# EAGLE design Amplifier (EAGLE 7.2.0)
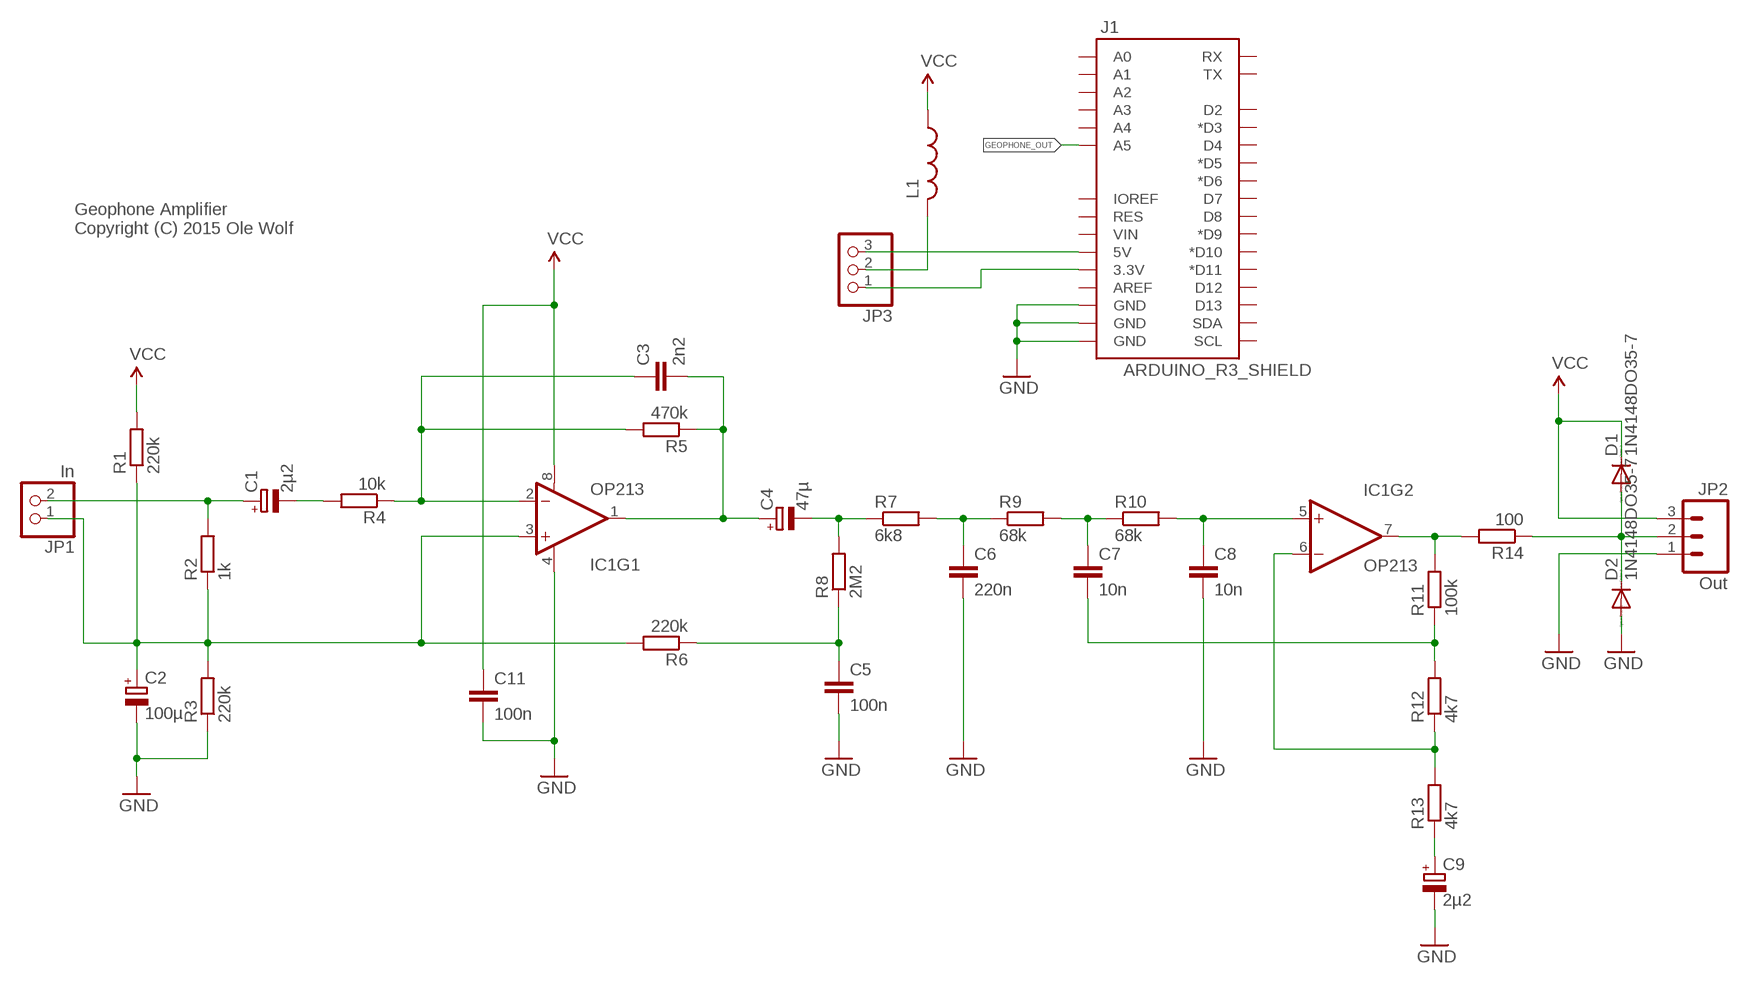
[diagram p0: schematic, sheet 1]

## Parts
C1  2µ2  CPOL-EUE2-5  [E2-5]
C2  100µ  CPOL-EUE2-5  [E2-5]
C3  2n2  C-EU025-025X050  [C025-025X050]
C4  47µ  CPOL-EUE2-5  [E2-5]
C5  100n  C-EU025-025X050  [C025-025X050]
C6  220n  C-EU025-025X050  [C025-025X050]
C7  10n  C-EU025-025X050  [C025-025X050]
C8  10n  C-EU025-025X050  [C025-025X050]
C9  2µ2  CPOL-EUE2-5  [E2-5]
C11  100n  C-EU025-025X050  [C025-025X050]
D1  1N4148DO35-7  [DO35-7]
D2  1N4148DO35-7  [DO35-7]
IC1  OP213  LM358  [DIP08]
J1  ARDUINO_R3_SHIELD  [UNO_R3_SHIELD]
JP1  In  PINHD-1X2  [1X02]
JP2  Out  M03LONGPADS  [1X03_LONGPADS]
JP3  PINHD-1X3  [1X03]
L1  L-US0207/2V  [0207/2V]
R1  220k  R-EU_0207/12  [0207/12]
R2  1k  R-EU_0207/12  [0207/12]
R3  220k  R-EU_0207/12  [0207/12]
R4  10k  R-EU_0207/12  [0207/12]
R5  470k  R-EU_0207/12  [0207/12]
R6  220k  R-EU_0207/12  [0207/12]
R7  6k8  R-EU_0207/12  [0207/12]
R8  2M2  R-EU_0207/12  [0207/12]
R9  68k  R-EU_0207/12  [0207/12]
R10  68k  R-EU_0207/12  [0207/12]
R11  100k  R-EU_0207/12  [0207/12]
R12  4k7  R-EU_0207/12  [0207/12]
R13  4k7  R-EU_0207/12  [0207/12]
R14  100  R-EU_0207/12  [0207/12]

## Nets
GEOPHONE_OUT: D1.A D2.C J1.A5 JP2.2 R14.1
GND: C2.- C5.2 C6.2 C8.2 C9.- C11.2 D2.A IC1.4(V-) J1.GND@0(GND) J1.GND@1(GND) J1.GND@2(GND) JP2.1 R3.1
N$1: C2.+ IC1.3(+IN) JP1.1 R1.1 R2.1 R3.2 R6.2
N$2: C1.- R4.2
N$3: C5.1 R6.1 R8.1
N$4: C3.1 IC1.2(-IN) R4.1 R5.2
N$5: C1.+ JP1.2 R2.2
N$6: C6.1 R7.2 R9.1
N$7: JP3.2 L1.2
N$8: IC1.6(-IN) R12.1 R13.2
N$9: C3.2 C4.+ IC1.1(OUT) R5.1
N$10: C4.- R7.1 R8.2
N$11: C7.1 R9.2 R10.1
N$12: C9.+ R13.1
N$13: C8.1 IC1.5(+IN) R10.2
N$14: J1.3.3V JP3.1
N$15: C7.2 R11.1 R12.2
N$16: IC1.7(OUT) R11.2 R14.2
N$17: J1.5V JP3.3
VCC: C11.1 D1.C IC1.8(V+) JP2.3 L1.1 R1.2
Unconnected: J1.A0 J1.A1 J1.A2 J1.A3 J1.A4 J1.AREF J1.D2 J1.D3(*D3) J1.D4 J1.D5(*D5) J1.D6(*D6) J1.D7 J1.D8 J1.D9(*D9) J1.D10(*D10) J1.D11(*D11) J1.D12 J1.D13 J1.IOREF J1.RES J1.RX J1.SCL J1.SDA J1.TX J1.VIN

## Notes on the sheet
- Geophone Amplifier
  Copyright (C) 2015 Ole Wolf

## Library data of the parts
C1 C2 C4 C9 = rcl:CPOL-EU: POLARIZED CAPACITOR, European symbol
C3 C5-C8 C11 = rcl:C-EU: CAPACITOR, European symbol
D1 D2 = diode:1N4148: DIODE high speed (Philips)
IC1 = SparkFun-AnalogIC:LM358: Jellybean op-amp; PROD_ID: IC-09172
J1 = SparkFun-Boards:ARDUINO_R3_SHIELD: Shield form compatible with the Arduino Uno R3.
JP1 = pinhead:PINHD-1X2: PIN HEADER
JP2 = SparkFun-Connectors:M03: Header 3 Standard 3-pin 0.1" header. Use with straight break away headers (SKU : PRT-00116), right angle break away headers (PRT-00553), swiss pins (PRT-00743), machine pins (PRT-00117), and female headers (PRT-00115). Molex polarized connector foot print use with SKU : PRT-08232 with associated crimp pins and housings.
JP3 = pinhead:PINHD-1X3: PIN HEADER
L1 = rcl:L-US: INDUCTOR, American symbol
R1-R14 = resistor:R-EU_: RESISTOR, European symbol

## Board
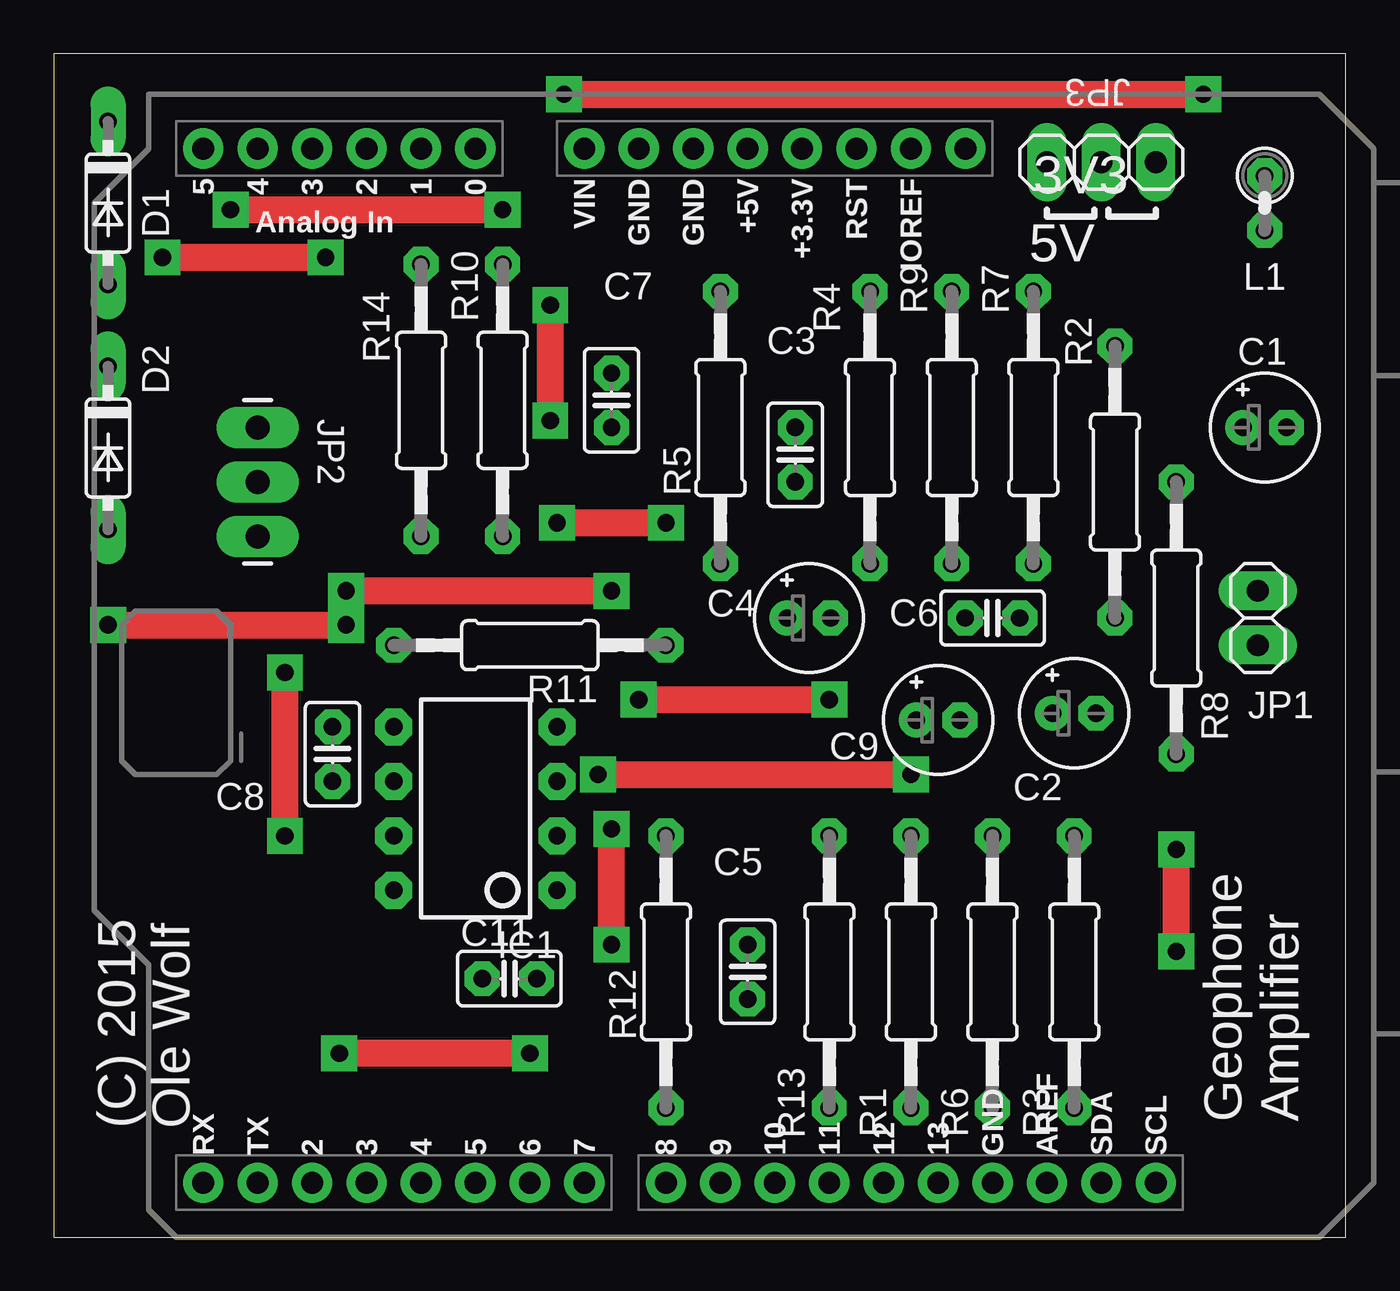
[diagram p1: board, top side]
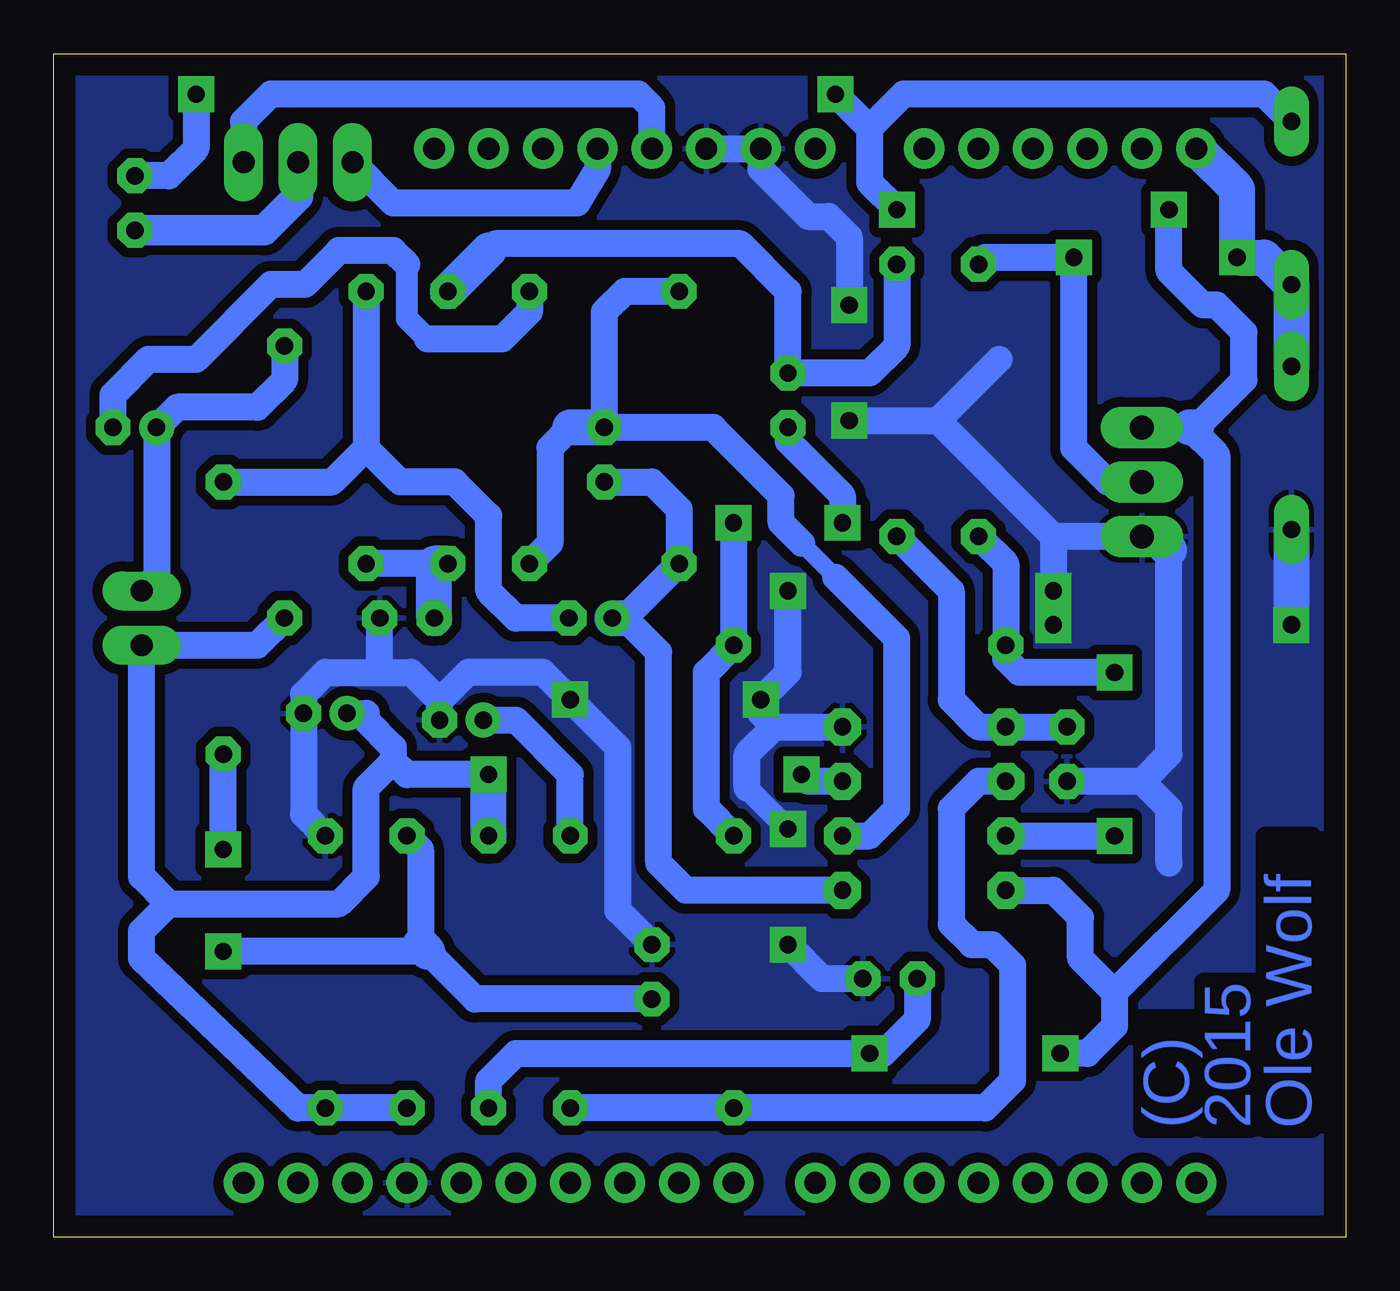
[diagram p2: board, bottom side, seen from below]

Size 60.3 x 55.23 mm. Coordinates in mm from the lower left corner, seen from the top.
Outline: 0,0 60.3,0 60.3,55.23 0,55.23 0,0
Copper layers (1*16): Top 0.035mm / dielectric 1.5mm / Bottom 0.035mm
Design rules "default *": minimum track width 10mil, minimum drill 24mil, track to track 18mil, track to pad 18mil, pad to pad 18mil, via to via 18mil, smd to smd 8mil, copper to edge 40mil, drill to drill 8mil, minimum pad ring 16mil, minimum via ring 12mil, stop-mask expansion 4mil, vias tented up to drill 0mil, thermal gap 10mil

### Footprints (pad centres in the part's own frame; a part is rotated, then mirrored left to right if it is on the bottom)
E2-5 = drill 0.813 pad 1.27: + -1.016,0 | drill 0.813 pad 1.27 octagon: - 1.016,0
C025-025X050 = drill 0.813 octagon: 1 -1.27,0; 2 1.27,0
DO35-7 = drill 0.813 long: A 3.81,0; C -3.81,0
DIP08 = drill 0.813 pad 1.727 octagon: 1 -3.81,-3.81; 2 -1.27,-3.81; 3 1.27,-3.81; 4 3.81,-3.81; 5 3.81,3.81; 6 1.27,3.81; 7 -1.27,3.81; 8 -3.81,3.81
UNO_R3_SHIELD = drill 1.016 pad 1.88: 3.3V 50.8,26.67; 5V 50.8,29.21; A0 50.8,41.91; A1 50.8,44.45; A2 50.8,46.99; A3 50.8,49.53; A4 50.8,52.07; A5 50.8,54.61; AREF 2.54,15.24; D2 2.54,49.53; D3 2.54,46.99; D4 2.54,44.45; D5 2.54,41.91; D6 2.54,39.37; D7 2.54,36.83; D8 2.54,33.02; D9 2.54,30.48; D10 2.54,27.94; D11 2.54,25.4; D12 2.54,22.86; D13 2.54,20.32; GND@0 50.8,31.75; GND@1 50.8,34.29; GND@2 2.54,17.78; IOREF 50.8,21.59; NC 50.8,19.05; RES 50.8,24.13; RX 2.54,54.61; SCL 2.54,10.16; SDA 2.54,12.7; TX 2.54,52.07; VIN 50.8,36.83
1X02 = drill 1.016 long: 1 -1.27,0; 2 1.27,0
1X03_LONGPADS = drill 1.118 pad 1.88 long: 1 0,0; 2 2.54,0; 3 5.08,0
1X03 = drill 1.016 long: 1 -2.54,0; 2 0,0; 3 2.54,0
0207/2V = drill 0.813 octagon: 1 -1.27,0; 2 1.27,0
0207/12 = drill 0.813 octagon: 1 -6.35,0; 2 6.35,0

### Placement (x,y rotation side)
C1  56.52,37.78 0 top
C2  47.62,24.45 0 top
C3  34.61,36.51 270 top
C4  35.24,28.89 0 top
C5  32.38,12.38 90 top
C6  43.81,28.89 0 top
C7  26.04,39.05 270 top
C8  13.02,22.54 270 top
C9  41.27,24.13 0 top
C11  21.27,12.06 0 top
D1  2.54,48.26 270 top
D2  2.54,36.83 270 top
IC1  19.68,20 90 top
J1  61.59,0 90 top
JP1  56.2,28.89 90 top
JP2  9.53,32.7 90 top
JP3  48.9,50.16 0 top
L1  56.52,48.26 270 top
R1  40.01,12.38 270 top
R2  49.53,35.24 90 top
R3  47.62,12.38 270 top
R4  38.1,37.78 90 top
R5  31.11,37.78 90 top
R6  43.81,12.38 270 top
R7  45.72,37.78 270 top
R8  52.39,28.89 90 top
R9  41.91,37.78 90 top
R10  20.95,39.05 270 top
R11  22.23,27.62 180 top
R12  28.57,12.38 90 top
R13  36.2,12.38 270 top
R14  17.14,39.05 270 top

### Tracks (layer width: path | path; a pad name or v marks a point on that pad's centre or on a via)
GEOPHONE_OUT  (via drill 0.8 pad 1.68)
  Top 1.27: v12.7,45.72 v5.08,45.72
  Bottom 1.27: JP2.2 11.11,35.24 12.7,36.83 v12.7,45.72 16.83,45.72 R14.1
  Bottom 1.676: J1.A5 5.08,48.9 v5.08,45.72 3.81,45.72 D1.A D2.C
GND  (via drill 0.8 pad 1.68)
  Top 1.27: v27.3,25.08 v36.2,25.08 | v26.04,30.16 v13.65,30.16 | v23.18,43.5 v23.18,38.1 | v2.54,28.57 v13.65,28.57 | v26.04,13.65 v26.04,19.05
  Bottom 1.016: v26.04,19.05 27.94,20.95
  Bottom 1.27: R3.1 48.64,19.75 C2.- 48.64,25.34 47.62,26.35 45.09,26.35 | 8.26,32.07 8.26,22.54 9.53,21.27 | 8.26,17.46 8.26,20 9.53,21.27 | v26.04,30.16 26.04,26.35 v27.3,25.08 27.3,24.45 26.67,23.81 | C5.2 33.97,15.24 33.97,22.86 v36.2,25.08 37.47,26.35 40.96,26.35 42.29,25.02 | 9.53,21.27 C8.2 | 45.09,26.35 C6.2 | 13.65,32.7 v13.65,30.16 | 13.65,32.7 19.05,38.1 | 26.67,23.81 IC1.4 | J1.GND@0 J1.GND@1 27.3,49.85 25.08,47.62 24.13,47.62 23.18,46.67 v23.18,43.5 | v23.18,38.1 19.05,38.1 | C9.- 42.29,25.02 | 45.09,26.35 43.62,26.35 42.29,25.02 | C11.2 24.45,12.06 v26.04,13.65 | 27.94,20.95 27.94,22.54 26.67,23.81 | 16.19,40.96 19.05,38.1 | JP2.1 13.65,32.7
  Bottom 1.676: 8.26,32.07 8.89,32.7 JP2.1 | D2.A v2.54,28.57 | v13.65,28.57 v13.65,30.16
  pour Bottom: 0,0 60.33,0 60.33,55.24 0,55.24
N$1  (via drill 0.8 pad 1.68)
  Top 1.27: v25.4,21.59 v40.01,21.59
  Bottom 1.27: 54.93,15.56 56.2,14.29 56.2,13.02 48.9,6.03 R3.2 R6.2 | IC1.3 25.08,21.27 v25.4,21.59 | R2.1 50.8,27.62 JP1.1 56.2,16.83 54.93,15.56 | 54.93,15.56 46.99,15.56 45.72,16.83 45.72,20.95 44.45,22.23 | v40.01,21.59 43.81,21.59 44.45,22.23 | C2.+ 45.72,24.45 45.72,24.13 44.45,22.86 44.45,22.23
  Bottom 1.676: R1.1 v40.01,21.59
N$2
  Bottom 1.016: 42.86,41.91 43.81,42.86 43.81,45.4
  Bottom 1.27: R4.2 38.1,43.18 39.37,41.91 42.86,41.91 | 43.81,45.4 44.45,46.04 46.99,46.04 48.58,44.45 50.16,44.45 53.66,40.96 55.88,40.96 57.53,39.31 C1.-
N$3  (via drill 0.8 pad 1.68)
  Top 1.27: v52.39,13.34 v52.39,18.1
  Bottom 1.27: v52.39,18.1 R8.1 | C5.1 40.64,11.11 42.86,13.34 v52.39,13.34 | R6.1 43.18,18.1 43.18,13.65
  Bottom 1.676: 43.18,13.65 42.86,13.34
N$4
  Bottom 0.813: 23.81,30.8 25.4,32.38
  Bottom 1.27: IC1.2 22.23,18.73 20.95,20 20.95,27.94 23.81,30.8 | R5.2 33.66,44.13 34.61,43.18 C3.1 29.53,37.78 26.35,34.61 26.35,33.34 25.4,32.38 | 36.2,37.78 37.15,36.83 37.15,32.38 R4.1
  Bottom 1.676: C3.1 36.2,37.78
N$5
  Bottom 1.27: R2.2 49.53,40.01 50.8,38.73 54.55,38.73 C1.+ 55.5,30.86 JP1.2
N$6
  Bottom 1.27: 42.55,31.43 R7.2
  Bottom 1.676: R9.1 42.55,31.43 C6.1
N$7
  Bottom 1.422: JP3.2 48.9,48.58 50.48,46.99 L1.2
N$8
  Bottom 1.27: R13.2 R12.1 16.83,6.03 15.56,7.3 15.56,12.7 16.51,13.65 17.46,13.65 18.41,14.61 18.41,20 17.14,21.27 IC1.6
N$9
  Bottom 1.27: IC1.1 30.8,16.19 32.07,17.46 32.07,27.3 33.66,28.89 R5.1 31.11,33.97 32.38,35.24 C3.2
  Bottom 1.676: C4.+ 33.66,28.89
N$10
  Bottom 1.27: C4.- 38.73,28.89 40.01,30.16 40.01,33.66 41.59,35.24 44.13,35.24 45.72,36.83 | R7.1 45.72,36.83 | 45.72,36.83 47.31,35.24 R8.2
N$11
  Bottom 1.27: R10.1 20.95,41.59 22.23,40.32 C7.1 26.04,44.13 28.26,46.35 39.69,46.35 40.01,46.04
  Bottom 1.676: 40.01,46.04 R9.2
N$12
  Bottom 1.27: R13.1 36.2,21.59 38.73,24.13 C9.+
N$13
  Bottom 1.27: R10.2 18.41,30.16 18.41,25.08 17.14,23.81 IC1.5 C8.1
N$14
  Bottom 1.27: J1.3.3V 34.92,49.85 35.88,48.26 44.45,48.26 JP3.1
N$15  (via drill 0.8 pad 1.68)
  Top 1.27: v23.5,33.34 v28.57,33.34
  Bottom 1.27: R12.2 29.84,20 29.84,26.35 R11.1 v28.57,33.34 | C7.2 26.04,37.15 23.5,34.61 v23.5,33.34
N$16  (via drill 0.8 pad 1.68)
  Top 1.27: v10.79,18.73 v10.79,26.35
  Bottom 1.27: R14.2 15.88,31.43 R11.2 15.88,26.99 15.24,26.35 v10.79,26.35 | IC1.7 v10.79,18.73
N$17
  Bottom 1.27: J1.5V 32.38,52.7 33.02,53.34 50.16,53.34 51.44,52.07 JP3.3
VCC  (via drill 0.8 pad 1.68)
  Top 1.27: v22.23,8.57 v13.34,8.57 | v8.26,47.94 v20.95,47.94 | v23.81,53.34 v53.66,53.34
  Bottom 1.27: R1.2 40.01,7.3 38.73,8.57 v22.23,8.57 21.59,8.57 20,10.16 C11.1 | 6.99,37.78 4.76,40.01 4.76,42.23 6.03,43.5 6.67,43.5 8.26,45.09 v8.26,47.94 | JP2.3 7.3,37.78 6.03,36.51 6.03,16.19 10.79,11.43 | D1.C 3.81,53.34 20.64,53.34 22.23,51.75 | 22.23,51.75 22.23,49.21 v20.95,47.94 | v23.81,53.34 22.23,51.75 | 10.79,11.43 10.79,9.84 12.06,8.57 v13.34,8.57 | 10.79,11.43 12.38,13.02 12.38,14.92 13.65,16.19 IC1.8 | v53.66,53.34 53.66,50.8 54.93,49.53 L1.1
  Bottom 1.676: 7.3,37.78 6.99,37.78

### Text on the board
Bottom: Ole Wolf | 2015 | (C)
tNames: 3V3 | 5V | (C) 2015 | Ole Wolf | Geophone / Amplifier